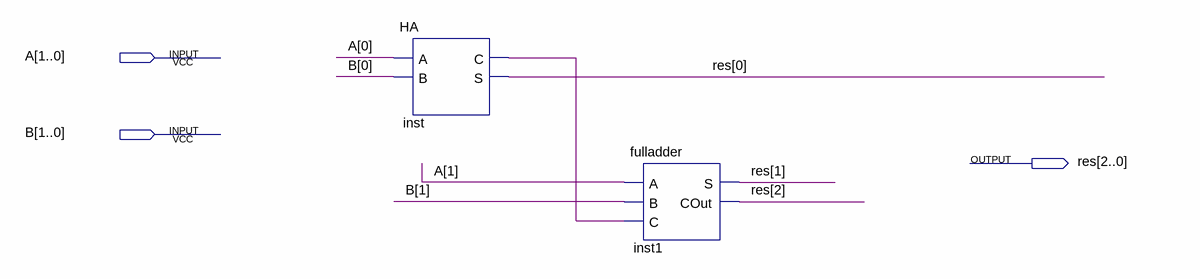
[diagram p0: schematic sheet]
// Quartus schematic 2bitFA.bdf as structural Verilog: 2 symbols, 3 pins
module \2bitFA  (
  input  [1:0] A,
  input  [1:0] B,
  output [2:0] res
);

  wire inst_c;

  HA inst (.A(A[0]), .B(B[0]), .C(inst_c), .S(res[0]));
  fulladder inst1 (.A(A[1]), .B(B[1]), .C(inst_c), .S(res[1]), .COut(res[2]));
endmodule
